# EAGLE design slotbuttons (EAGLE 5.10)
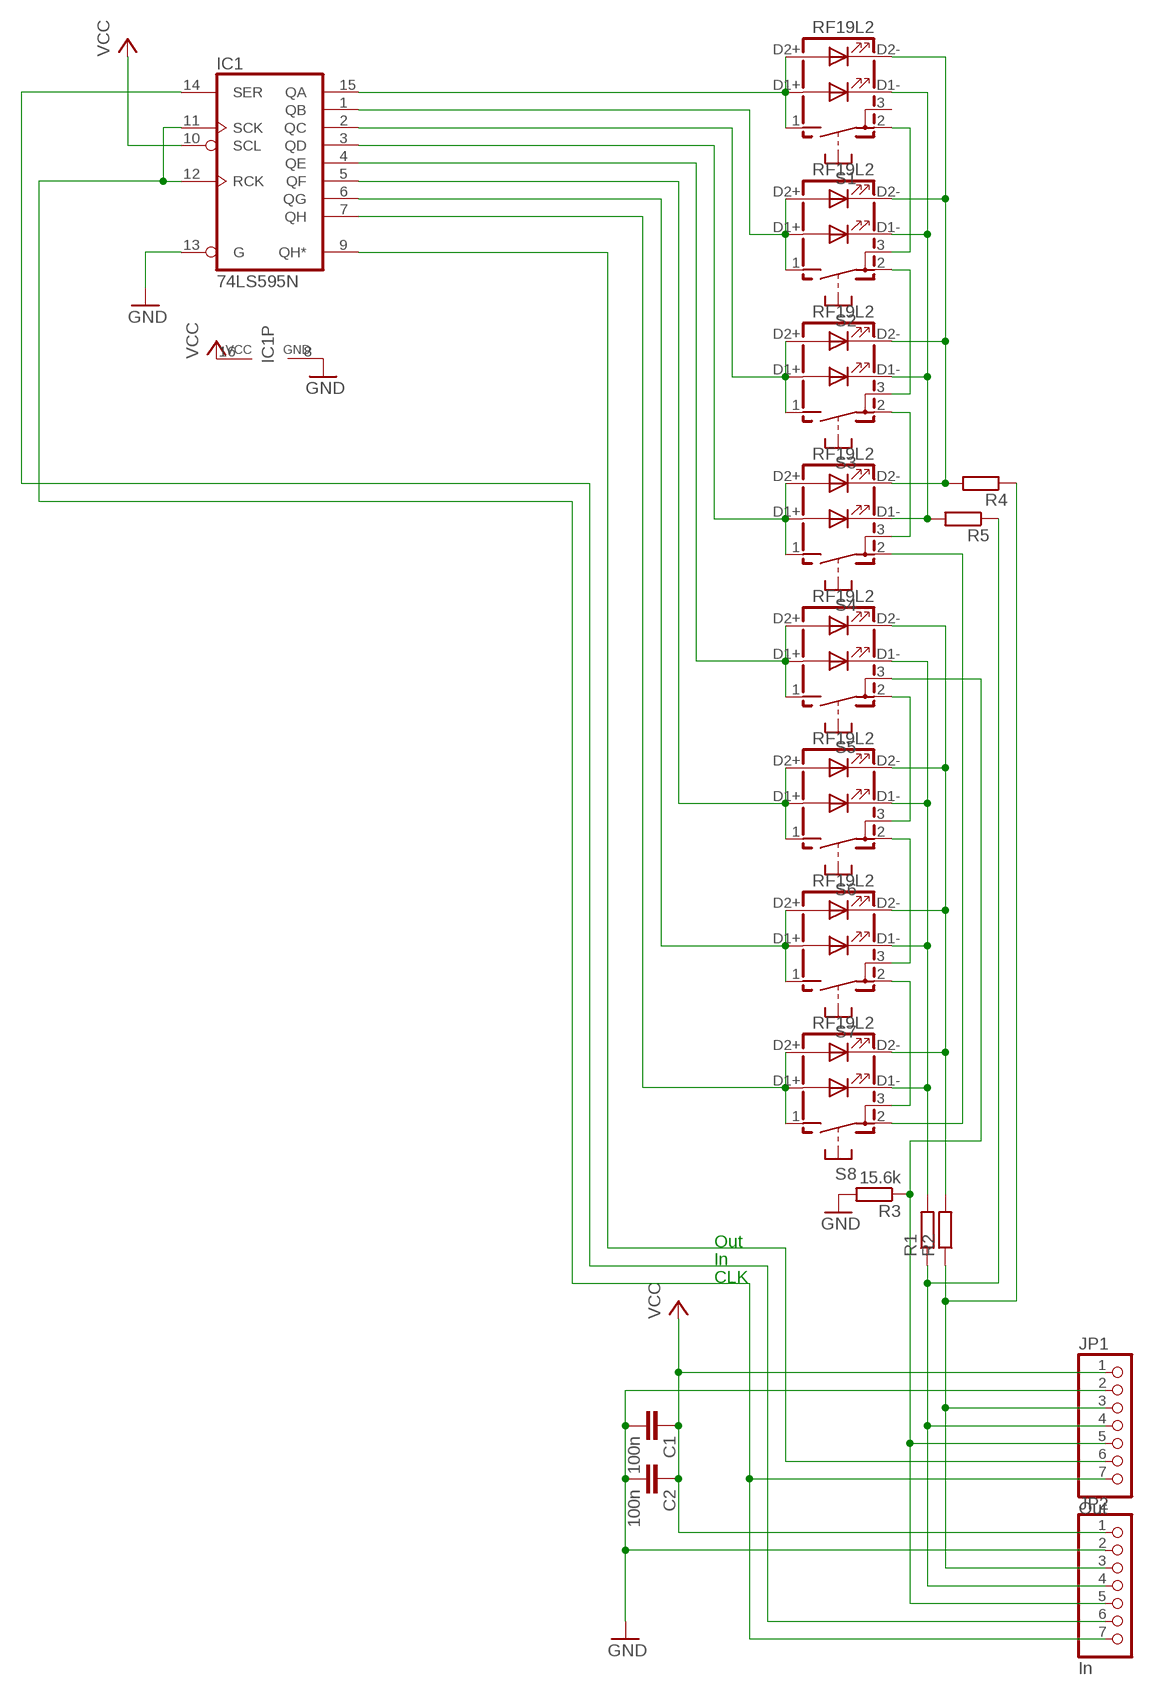
[diagram p0: schematic, sheet 1]

## Parts
C1  100n  C-EUC0603  [C0603]
C2  100n  C-EUC0603  [C0603]
IC1  74LS595N  [DIL16]
JP1  Out  PINHD-1X7  [1X07]
JP2  In  PINHD-1X7  [1X07]
R1  R-EU_0207/10  [0207/10]
R2  R-EU_0207/5V  [0207/5V]
R3  15.6k  R-EU_0207/10  [0207/10]
R4  R-EU_0207/10  [0207/10]
R5  R-EU_0207/10  [0207/10]
S1  RF19L2  [RF19L2]
S2  RF19L2  [RF19L2]
S3  RF19L2  [RF19L2]
S4  RF19L2  [RF19L2]
S5  RF19L2  [RF19L2]
S6  RF19L2  [RF19L2]
S7  RF19L2  [RF19L2]
S8  RF19L2  [RF19L2]

## Nets
GND: C1.2 C2.2 IC1.8(GND) IC1.13(G) JP1.2 JP2.2 R3.2
N$1: IC1.15(QA) S1.1(S) S1.D1+(A1) S1.D2+(A2)
N$2: IC1.1(QB) S2.1(S) S2.D1+(A1) S2.D2+(A2)
N$3: IC1.2(QC) S3.1(S) S3.D1+(A1) S3.D2+(A2)
N$4: IC1.3(QD) S4.1(S) S4.D1+(A1) S4.D2+(A2)
N$5: IC1.4(QE) S5.1(S) S5.D1+(A1) S5.D2+(A2)
N$6: IC1.5(QF) S6.1(S) S6.D1+(A1) S6.D2+(A2)
N$7: IC1.6(QG) S7.1(S) S7.D1+(A1) S7.D2+(A2)
N$8: IC1.7(QH) S8.1(S) S8.D1+(A1) S8.D2+(A2)
N$9: S2.2(P) S3.3(P)
N$10: S3.2(P) S4.3(P)
N$11: S4.2(P) S8.2(P)
N$12: S5.2(P) S6.3(P)
N$13: S6.2(P) S7.3(P)
N$14: S1.2(P) S2.3(P)
N$15: S7.2(P) S8.3(P)
N$16: JP1.5 JP2.5 R3.1 S5.3(P)
N$17: R1.2 S5.D1-(C1) S6.D1-(C1) S7.D1-(C1) S8.D1-(C1)
N$18: R2.2 S5.D2-(C2) S6.D2-(C2) S7.D2-(C2) S8.D2-(C2)
N$19: JP1.4 JP2.4 R1.1 R5.1
N$20: JP1.3 JP2.3 R2.1 R4.1
N$21: IC1.11(SCK) IC1.12(RCK) JP1.7 JP2.7
N$22: IC1.14(SER) JP2.6
N$23: IC1.9(QH*) JP1.6
N$24: R5.2 S1.D1-(C1) S2.D1-(C1) S3.D1-(C1) S4.D1-(C1)
N$25: R4.2 S1.D2-(C2) S2.D2-(C2) S3.D2-(C2) S4.D2-(C2)
VCC: C1.1 C2.1 IC1.10(SCL) IC1.16(VCC) JP1.1 JP2.1
Unconnected: S1.3(P)

## Notes on the sheet
- Out
- In
- CLK

## Library data of the parts
C1 C2 = rcl:C-EU: CAPACITOR, European symbol
IC1 = 74xx-eu:74*595: 8-bit SHIFT REGISTER, output latch
JP1 JP2 = pinhead:PINHD-1X7: PIN HEADER
R1-R5 = rcl:R-EU_: RESISTOR, European symbol
S1-S8 = switch-misc:RF19L2: RAFI SWITCH

## Board
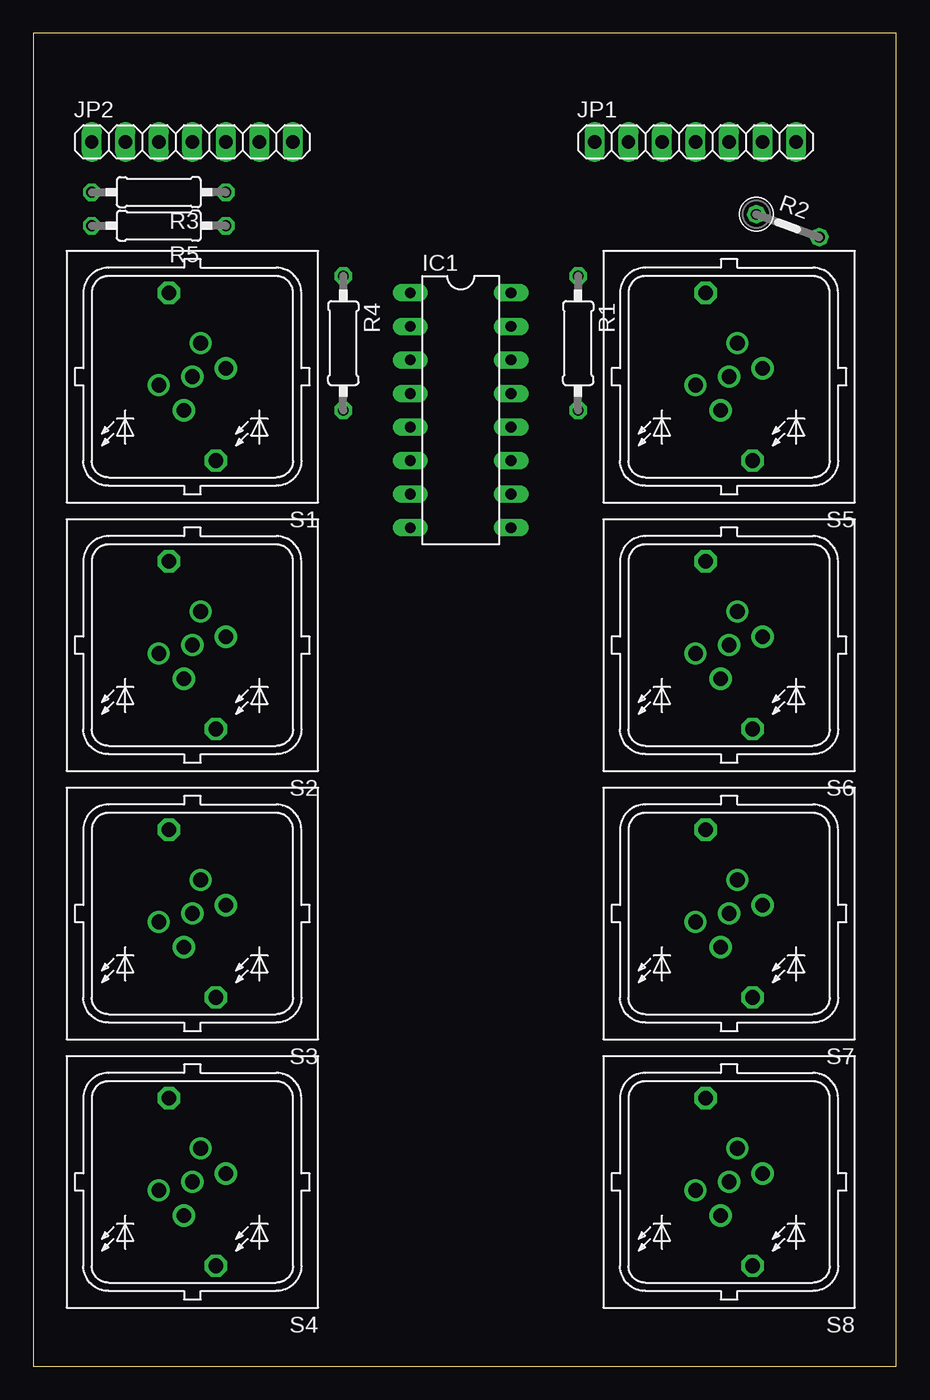
[diagram p1: board, top side]
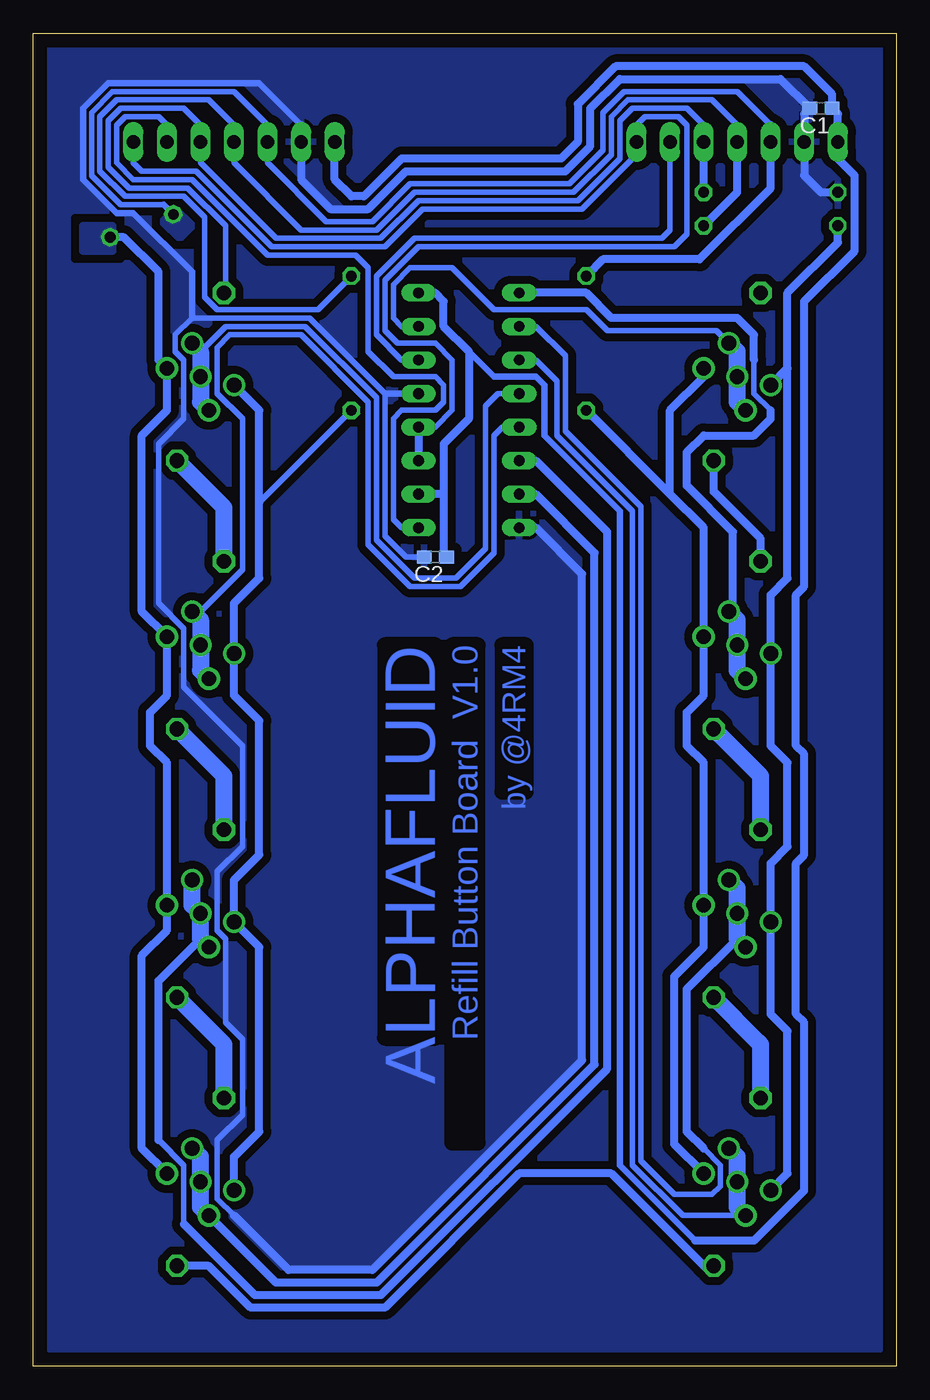
[diagram p2: board, bottom side, seen from below]

Size 65.39 x 100.95 mm. Coordinates in mm from the lower left corner, seen from the top.
Outline: 0,0 65.39,0 65.39,100.95 0,100.95 0,0
Copper layers (1*16): Top 0.035mm / dielectric 1.5mm / Bottom 0.035mm
Design rules "default *": minimum track width 10mil, minimum drill 24mil, track to track 7mil, track to pad 8mil, pad to pad 8mil, via to via 8mil, smd to smd 8mil, copper to edge 40mil, drill to drill 8mil, minimum pad ring 10mil, minimum via ring 8mil, stop-mask expansion 4mil, vias tented up to drill 0mil, thermal gap 10mil

### Footprints (pad centres in the part's own frame; a part is rotated, then mirrored left to right if it is on the bottom)
C0603 = smd 1.1 x 1: 1 -0.85,0; 2 0.85,0
DIL16 = drill 0.813 long: 1 -8.89,-3.81; 2 -6.35,-3.81; 3 -3.81,-3.81; 4 -1.27,-3.81; 5 1.27,-3.81; 6 3.81,-3.81; 7 6.35,-3.81; 8 8.89,-3.81; 9 8.89,3.81; 10 6.35,3.81; 11 3.81,3.81; 12 1.27,3.81; 13 -1.27,3.81; 14 -3.81,3.81; 15 -6.35,3.81; 16 -8.89,3.81
1X07 = drill 1.016 long: 1 -7.62,0; 2 -5.08,0; 3 -2.54,0; 4 0,0; 5 2.54,0; 6 5.08,0; 7 7.62,0
0207/10 = drill 0.813 octagon: 1 -5.08,0; 2 5.08,0
0207/5V = drill 0.813 octagon: 1 -2.54,0; 2 2.54,0
RF19L2 = drill 1.118 round: 1 0,0; D1+ 0.635,2.54; D1- 2.54,0.635; D2+ -0.635,-2.54; D2- -2.54,-0.635 | drill 1.118 octagon: 2 -1.778,6.35; 3 1.778,-6.35

### Placement (x,y rotation side)
C1  5.72,95.25 180 bottom
C2  34.92,61.28 180 bottom
IC1  32.39,72.39 270 top
JP1  50.17,92.71 0 top
JP2  12.06,92.71 0 top
R1  41.27,77.47 270 top
R2  57.15,86.36 340 top
R3  9.53,88.9 180 top
R4  23.5,77.47 270 top
R5  9.53,86.36 180 top
S1  12.06,74.93 180 top
S2  12.06,54.61 180 top
S3  12.06,34.29 180 top
S4  12.06,13.97 180 top
S5  52.7,74.93 180 top
S6  52.7,54.61 180 top
S7  52.7,34.29 180 top
S8  52.7,13.97 180 top

### Tracks (layer width: path | path; a pad name or v marks a point on that pad's centre or on a via)
GND
  Bottom 0.406: 50.17,11.43 51.43,12.7 51.43,17.14 49.53,19.05 49.53,24.77 50.8,26.04 50.8,32.38 51.43,33.02 51.43,37.46 49.53,39.37 49.53,46.99 53.98,51.43 53.98,55.88 55.88,57.78 55.88,69.85 53.98,71.76 53.98,76.2 54.61,76.84 54.61,78.11 53.34,79.38 44.45,79.38 38.73,73.66 38.73,62.87 37.15,61.28 C2.2
  Bottom 0.508: 38.73,73.66 IC1.13 | 53.34,79.38 53.34,82.87 57.79,87.31 59.05,87.31 61.6,89.85 61.6,95.25 59.69,97.16 48.26,97.16 45.08,93.98
  Bottom 0.61: 45.08,93.98 JP1.2 45.08,89.85 42.86,87.63 40.01,87.63 37.15,90.49 25.08,90.49 23.18,92.39 23.18,95.25 20.95,97.47 8.79,97.47 C1.2 6.98,94.83 JP2.2 6.98,90.17 5.72,88.9 R3.2 | IC1.8 27.3,63.5 23.81,60.01 23.81,23.18 39.69,7.3 46.04,7.3 50.17,11.43
  pour Bottom (isolate 0.61, rank 3): 1.27,100.01 1.27,1.27 64.14,1.27 64.14,100.01
N$1
  Bottom 0.406: S1.D2+ 13.65,78.42 21.91,78.42 23.5,80.01 30.48,80.01 33.66,83.19 36.83,83.19 38.1,81.92 38.1,79.38 37.47,78.74 IC1.15
  Bottom 1.27: S1.D1+ 12.06,73.03 S1.1 12.06,76.84 S1.D2+
N$2
  Bottom 0.406: 9.53,72.39 10.8,73.66 10.8,76.2
  Bottom 0.61: S2.D2+ 12.38,57.47 12.38,63.18 15.88,66.67 15.88,69.22 14.61,70.48 10.8,70.48 9.53,71.76 9.53,72.39 | 10.8,76.2 10.8,78.11 12.06,79.38 21.59,79.38 23.5,81.28 IC1.1
  Bottom 1.27: S2.D1+ 12.06,52.7 S2.1 12.06,56.51 S2.D2+
N$3
  Bottom 0.406: 14.61,16.51 13.33,15.24 13.33,13.65 13.97,13.02 16.83,13.02 19.37,15.56 19.37,65.09 25.08,70.8 25.08,76.52 27.3,78.74 IC1.2
  Bottom 0.61: 14.61,16.51 15.88,17.78 15.88,28.57 12.06,32.38
  Bottom 1.27: S3.D2+ 12.06,36.2 S3.1 12.06,32.38 S3.D1+
N$4
  Bottom 0.406: S4.D1+ 16.19,11.43 20,15.24 20,64.77 25.72,70.48 25.72,74.61 27.3,76.2 IC1.3
  Bottom 1.27: S4.D2+ 12.06,15.88 S4.1 12.06,12.07 S4.D1+
N$5
  Bottom 0.406: IC1.4 30.16,73.66 31.11,72.71 31.11,61.91 33.34,59.69 36.51,59.69 39.37,62.55 39.37,73.34 44.77,78.74 50.8,78.74 52.7,76.84
  Bottom 1.27: S5.D1+ 52.7,73.03 S5.1 52.7,76.84 S5.D2+
N$6
  Bottom 0.406: IC1.5 29.84,71.12 30.48,70.48 30.48,61.59 33.02,59.05 36.83,59.05 40.01,62.23 40.01,73.03 45.08,78.11 50.48,78.11 51.43,77.15 51.43,73.66 49.53,71.76 49.53,60.32 52.7,57.15 S6.D2+
  Bottom 1.27: S6.D1+ 52.7,52.7 S6.1 52.7,56.51 S6.D2+
N$7
  Bottom 0.406: 53.98,10.79 53.98,15.24 55.88,17.14
  Bottom 0.61: IC1.6 27.3,68.58 21.91,63.18 21.91,22.54 39.05,5.4 48.58,5.4 53.98,10.79 | 55.88,17.14 55.88,29.21 52.7,32.38
  Bottom 1.27: S7.D1+ 52.7,32.38 S7.1 53.34,34.92 S7.D2+
N$8
  Bottom 0.61: IC1.7 27.3,66.04 22.86,61.59 22.86,22.86 39.37,6.35 46.99,6.35 S8.D1+
  Bottom 1.27: S8.D1+ 52.7,12.07 S8.1 52.7,15.88 S8.D2+
N$9
  Bottom 1.27: S2.2 10.29,44.7 S3.3
N$10
  Bottom 0.61: 10.29,24.38 10.41,24.51
  Bottom 1.27: 10.41,24.51 S3.2 | S4.3 10.29,24.38
N$11
  Bottom 0.61: S4.2 14.61,7.62 21.59,14.61 28.58,14.61 38.73,4.45 48.89,4.45 52.07,7.62 S8.2
N$12
  Bottom 1.27: S5.2 50.93,65.02 S6.3
N$13
  Bottom 1.27: S6.2 50.93,44.7 S7.3
N$14
  Bottom 0.61: S1.2 13.84,66.23 10.29,62.67 S2.3
N$15
  Bottom 1.27: S7.2 50.93,24.38 S8.3
N$16
  Bottom 0.406: S5.3 50.8,81.28 50.8,86.36 53.66,89.22 58.1,89.22 59.69,90.81 59.69,94.3 58.74,95.25 53.98,95.25 52.7,93.98 JP1.5 52.7,91.12 46.99,85.41 39.05,85.41 36.19,88.27 24.13,88.27 20.95,91.44 20.95,94.3 20,95.25 15.88,95.25 14.61,93.98 JP2.5
  Bottom 0.61: R3.1 JP2.5
N$17
  Bottom 0.406: 48.26,65.41 R1.2
  Bottom 0.61: S8.D1- 50.17,15.88 48.26,17.78 48.26,31.75 S7.D1- 50.17,36.83 48.26,38.73 48.26,48.89 50.17,50.8 S6.D1- 50.17,57.78 48.26,59.69 48.26,65.41 48.26,72.39 S5.D1-
N$18
  Bottom 0.61: S8.D2- 57.15,16.51 57.15,31.11 55.24,33.02 S7.D2- 55.24,45.72 56.52,46.99 56.52,49.53 55.24,50.8 S6.D2- 57.15,57.15 57.15,70.48 55.24,72.39 S5.D2- 55.88,76.2 55.88,82.87 58.5,85.49 R2.2
  pour Bottom (no thermals): 59.37,86.36 59.37,84.45 61.6,84.45 61.6,86.36
N$19
  Bottom 0.406: JP2.4 12.06,93.98 13.97,95.89 20.32,95.89 21.59,94.62 21.59,91.76 24.45,88.9 36.51,88.9 39.37,86.04 45.08,86.04 50.17,91.12 JP1.4 50.17,93.98 52.07,95.89 59.05,95.89 60.33,94.62 60.33,90.49 58.42,88.58 53.98,88.58 52.39,87 52.39,80.96 51.43,80.01 43.82,80.01 R1.1
  Bottom 0.61: R5.1 12.06,88.9 JP2.4
N$20
  Bottom 0.406: 9.53,93.98 12.06,96.52 20.64,96.52 22.22,94.93 22.22,92.08 24.77,89.54 36.83,89.54 39.69,86.68 43.18,86.68 47.62,91.12 JP1.3 47.62,93.98 50.17,96.52 59.37,96.52 60.96,94.93 60.96,90.17 58.74,87.95 55.48,87.95
  Bottom 0.508: 55.48,87.95 R2.1
  Bottom 0.61: R4.1 22.22,83.82 14.92,83.82 9.53,89.22 JP2.3 9.53,93.98
  pour Bottom (no thermals): 53.34,86.36 54.61,87.63 55.56,86.68 54.29,85.41
N$21
  Bottom 0.406: IC1.12 34.92,71.12 33.66,72.39 33.66,76.2 34.92,77.47 37.78,77.47 38.73,78.42 38.73,82.23 36.19,84.77 16.83,84.77 15.88,85.73 15.88,93.98 16.51,94.62 19.05,94.62 19.69,93.98 JP2.7 19.69,91.76 23.81,87.63 35.88,87.63 38.73,84.77 47.31,84.77 53.02,90.49 57.15,90.49 57.79,91.12 JP1.7
  Bottom 0.61: IC1.12 IC1.11
N$22
  Bottom 0.406: IC1.14 37.47,76.2 39.37,78.11 39.37,82.55 36.51,85.41 17.78,85.41 17.14,86.04 JP2.6
N$23
  Bottom 0.406: JP1.6 55.24,93.98 55.88,94.62 58.42,94.62 59.05,93.98 59.05,91.12 57.79,89.85 53.34,89.85 47.62,84.14 40.96,84.14 40.01,83.19 40.01,76.84 38.1,74.93 34.92,74.93 34.29,74.3 34.29,73.03 34.92,72.39 37.47,72.39 38.1,71.76 38.1,64.14 37.47,63.5 IC1.9
N$24
  Bottom 0.61: 8.25,75.56 8.25,59.69 9.53,58.42 S2.D1- 9.53,46.99 8.25,45.72 8.25,39.37 9.53,38.1 S3.D1- 9.53,26.67 8.25,25.4 8.25,14.61 S4.D1- | 8.25,75.56 S1.D1- | R5.2 4.44,85.09 8.25,81.28 8.25,75.56
N$25
  Bottom 0.61: S4.D2- 16.83,16.83 16.83,29.53 14.61,31.75 S3.D2- 14.61,45.72 15.88,46.99 15.88,49.53 14.61,50.8 S2.D2- 14.61,63.5 17.14,66.04 | 17.14,66.04 17.14,72.39 14.61,74.93 S1.D2- | 17.14,66.04 R4.2
VCC
  Bottom 0.406: 34.29,61.17 C2.1
  Bottom 0.508: 32.39,76.84 30.48,74.93 27.3,74.93 26.67,74.3 26.67,70.48 20.95,64.77 20.95,15.24 15.24,9.53
  Bottom 0.61: 34.29,66.04 34.29,69.85 32.39,71.76 32.39,76.84 34.29,78.74 34.29,80.65 34.92,81.28 IC1.16 | 34.29,66.04 IC1.10 | 34.29,66.04 34.29,61.17 | 15.24,9.53 10.8,9.53 6.98,13.34 6.98,26.04 7.62,26.67 7.62,38.1 6.98,38.73 6.98,46.35 7.62,46.99 7.62,58.42 6.98,59.05 6.98,80.65 3.17,84.45 3.17,90.17 4.44,91.44 JP2.1 4.44,94.83 C1.1 4.86,96.31 6.98,98.42 21.27,98.42 24.13,95.57 24.13,92.71 25.4,91.44 37.47,91.44 40.32,88.58 41.27,88.58 42.55,89.85 JP1.1

### Text on the board
Bottom: by @4RM4 | Refill Button Board V1.0 | ALPHAFLUID